# EAGLE schematic asdr-dual (EAGLE 6.5.0)
CV Gate Triggered ASDR Adapted from: http://www.uni-bonn.de/~uzs159
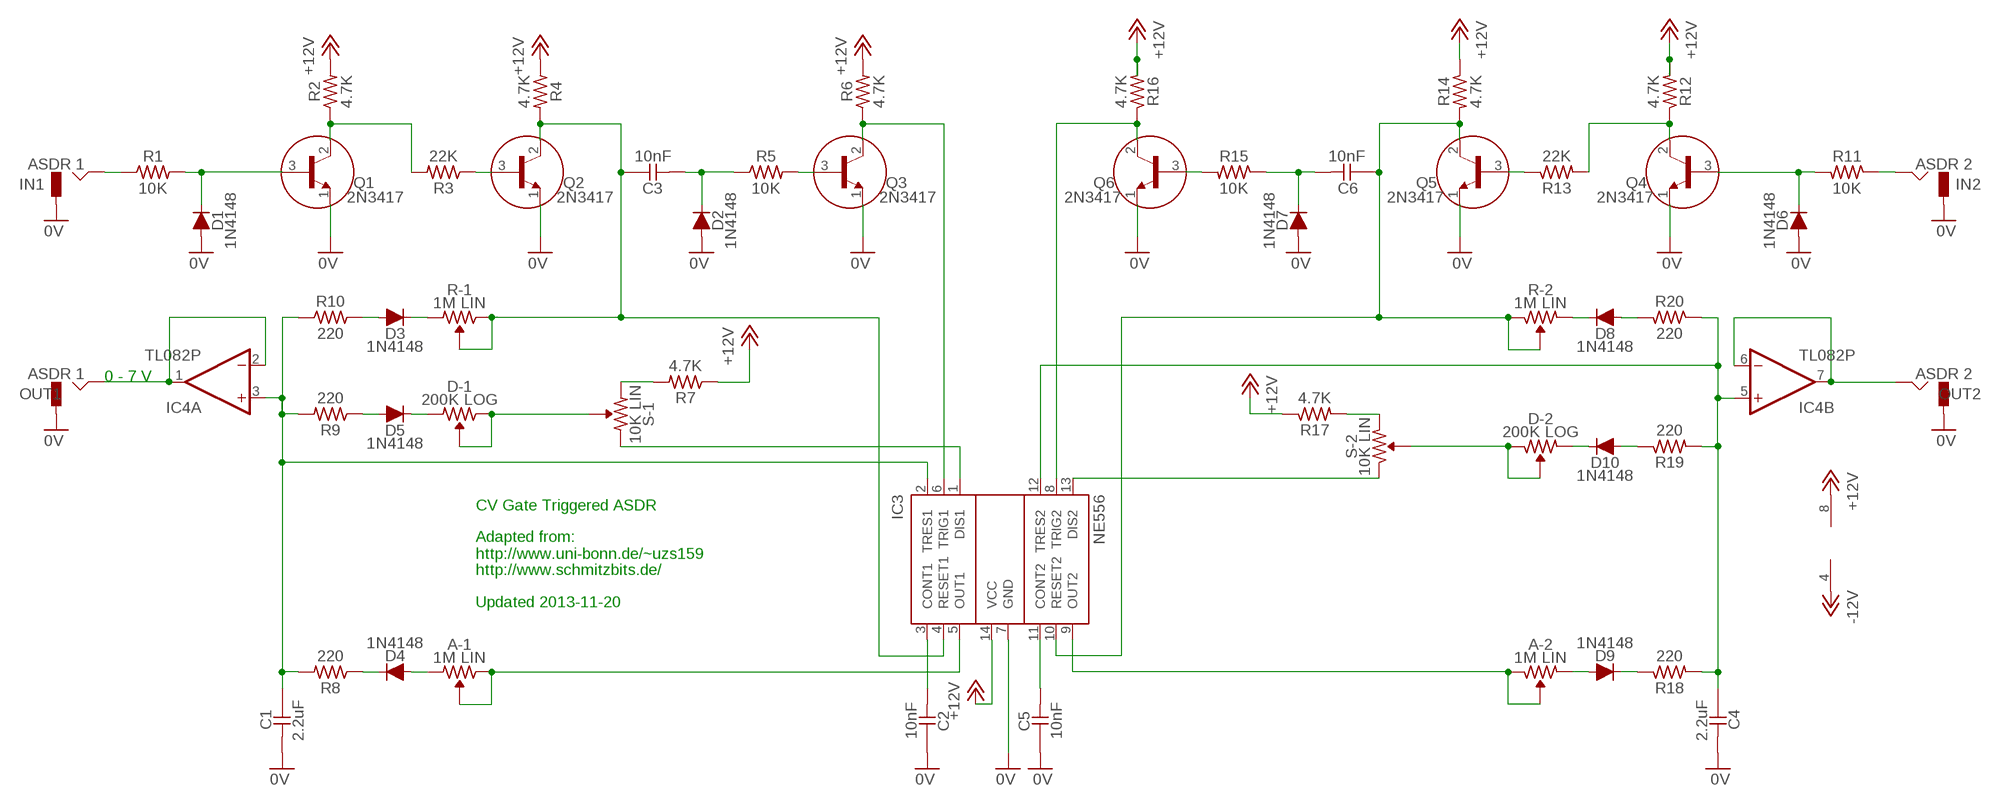
[diagram p0: schematic, sheet 1]

## Parts
A-1  1M LIN  R-VAR  [R-VAR]
A-2  1M LIN  R-VAR  [R-VAR]
C1  2.2uF  CC-US025-024X044  [C025-024X044]
C2  10nF  CC-US025-024X044  [C025-024X044]
C3  10nF  CC-US025-024X044  [C025-024X044]
C4  2.2uF  CC-US025-024X044  [C025-024X044]
C5  10nF  CC-US025-024X044  [C025-024X044]
C6  10nF  CC-US025-024X044  [C025-024X044]
D1  1N4148  [DO35-7]
D2  1N4148  [DO35-7]
D3  1N4148  [DO35-7]
D4  1N4148  [DO35-7]
D5  1N4148  [DO35-7]
D6  1N4148  [DO35-7]
D7  1N4148  [DO35-7]
D8  1N4148  [DO35-7]
D9  1N4148  [DO35-7]
D10  1N4148  [DO35-7]
D-1  200K LOG  R-VAR  [R-VAR]
D-2  200K LOG  R-VAR  [R-VAR]
IC3  NE556  [DIL14]
IC4  TL082P  [DIL08]
IN1  ASDR 1  JACK-M  [JACK-M]
IN2  ASDR 2  JACK-M  [JACK-M]
OUT1  ASDR 1  JACK-M  [JACK-M]
OUT2  ASDR 2  JACK-M  [JACK-M]
Q1  2N3417  [TO92]
Q2  2N3417  [TO92]
Q3  2N3417  [TO92]
Q4  2N3417  [TO92]
Q5  2N3417  [TO92]
Q6  2N3417  [TO92]
R1  10K  R0309/10  [0309/10]
R2  4.7K  R0309/10  [0309/10]
R3  22K  R0309/10  [0309/10]
R4  4.7K  R0309/10  [0309/10]
R5  10K  R0309/10  [0309/10]
R6  4.7K  R0309/10  [0309/10]
R7  4.7K  R0309/10  [0309/10]
R8  220  R0309/10  [0309/10]
R9  220  R0309/10  [0309/10]
R10  220  R0309/10  [0309/10]
R11  10K  R0309/10  [0309/10]
R12  4.7K  R0309/10  [0309/10]
R13  22K  R0309/10  [0309/10]
R14  4.7K  R0309/10  [0309/10]
R15  10K  R0309/10  [0309/10]
R16  4.7K  R0309/10  [0309/10]
R17  4.7K  R0309/10  [0309/10]
R18  220  R0309/10  [0309/10]
R19  220  R0309/10  [0309/10]
R20  220  R0309/10  [0309/10]
R-1  1M LIN  R-VAR  [R-VAR]
R-2  1M LIN  R-VAR  [R-VAR]
S-1  10K LIN  R-VAR  [R-VAR]
S-2  10K LIN  R-VAR  [R-VAR]

## Nets
0V: C1.2 C2.1 C4.2 C5.1 D1.A D2.A D6.A D7.A IC3.7(GND) IN1.GND IN2.GND OUT1.GND OUT2.GND Q1.1(E) Q2.1(E) Q3.1(E) Q4.1(E) Q5.1(E) Q6.1(E)
+12V: IC3.14(VCC) IC4.8(P:V+) R2.2 R4.1 R6.2 R7.1 R12.2 R14.1 R16.2 R17.1
-12V: IC4.4(P:V-)
N$1: IN1.HOT R1.1
N$2: D1.C Q1.3(B) R1.2
N$3: Q1.2(C) R2.1 R3.2
N$4: Q2.3(B) R3.1
N$5: C3.1 IC3.4(RESET1) Q2.2(C) R4.2 R-1.R1 R-1.VAR
N$6: C3.2 D2.C R5.1
N$7: Q3.3(B) R5.2
N$8: IC3.6(TRIG1) Q3.2(C) R6.1
N$9: D3.C R-1.R2
N$10: D3.A R10.2
N$11: C1.1 IC3.2(TRES1) IC4.3(A:+IN) R8.2 R9.2 R10.1
N$12: D4.C R8.1
N$13: A-1.R2 D4.A
N$14: D5.A R9.1
N$15: D5.C D-1.R2
N$16: D-1.R1 D-1.VAR S-1.VAR
N$17: A-1.R1 A-1.VAR IC3.5(OUT1)
N$18: IC3.1(DIS1) S-1.R1
N$19: R7.2 S-1.R2
N$20: C2.2 IC3.3(CONT1)
N$21: IN2.HOT R11.1
N$22: IC4.1(A:OUT) IC4.2(A:-IN) OUT1.HOT
N$23: D6.C Q4.3(B) R11.2
N$24: Q4.2(C) R12.1 R13.2
N$25: Q5.3(B) R13.1
N$26: C6.1 IC3.10(RESET2) Q5.2(C) R14.2 R-2.R1 R-2.VAR
N$27: C6.2 D7.C R15.1
N$28: Q6.3(B) R15.2
N$29: IC3.8(TRIG2) Q6.2(C) R16.1
N$30: D8.C R-2.R2
N$31: D8.A R20.2
N$32: C4.1 IC3.12(TRES2) IC4.5(B:+IN) R18.2 R19.2 R20.1
N$33: D9.C R18.1
N$34: A-2.R2 D9.A
N$35: D10.A R19.1
N$36: D10.C D-2.R2
N$37: D-2.R1 D-2.VAR S-2.VAR
N$38: A-2.R1 A-2.VAR IC3.9(OUT2)
N$39: IC4.6(B:-IN) IC4.7(B:OUT) OUT2.HOT
N$40: C5.2 IC3.11(CONT2)
N$41: IC3.13(DIS2) S-2.R1
N$42: R17.2 S-2.R2

## Notes on the sheet
- 0 - 7 V
- CV Gate Triggered ASDR
- Adapted from:
  http://www.uni-bonn.de/~uzs159
- http://www.schmitzbits.de/
- Updated 2013-11-20

## Library data of the parts
A-1 A-2 D-1 D-2 R-1 R-2 S-1 S-2 = _common:R-VAR
C1-C6 = _common:CC-US: CAPACITOR, US symbol
D1-D10 = _common:1N4148: DIODE high speed (Philips)
IC3 = st-microelectronics:NE556: General Purpose Biopolartimer; MPN: NE556; OC_FARNELL: 2349784; OC_NEWARK: 83C0108
IC4 = _common:TL082: OP AMP
IN1 IN2 OUT1 OUT2 = _common:JACK-M
Q1-Q6 = _common:2N3417: NPN Transistor
R1-R20 = _common:R: RESISTOR, US symbol